# Altium schematic sheet CuC.SchDoc: CuC
size A4; Author: eldar6776@hotmail.com; DrawnBy: Eldar Dedić; Organization: PROVEN d.o.o.; Address1: Adema Buće 102; Address2: 71000 Sarajevo; Address3: Federacija BiH; Address4: Bosna i Hercegovina; DocumentNumber: DE211213; Revision: 001; SheetNumber: 2; SheetTotal: 15; ProjectName: MIKSER SIROVINE
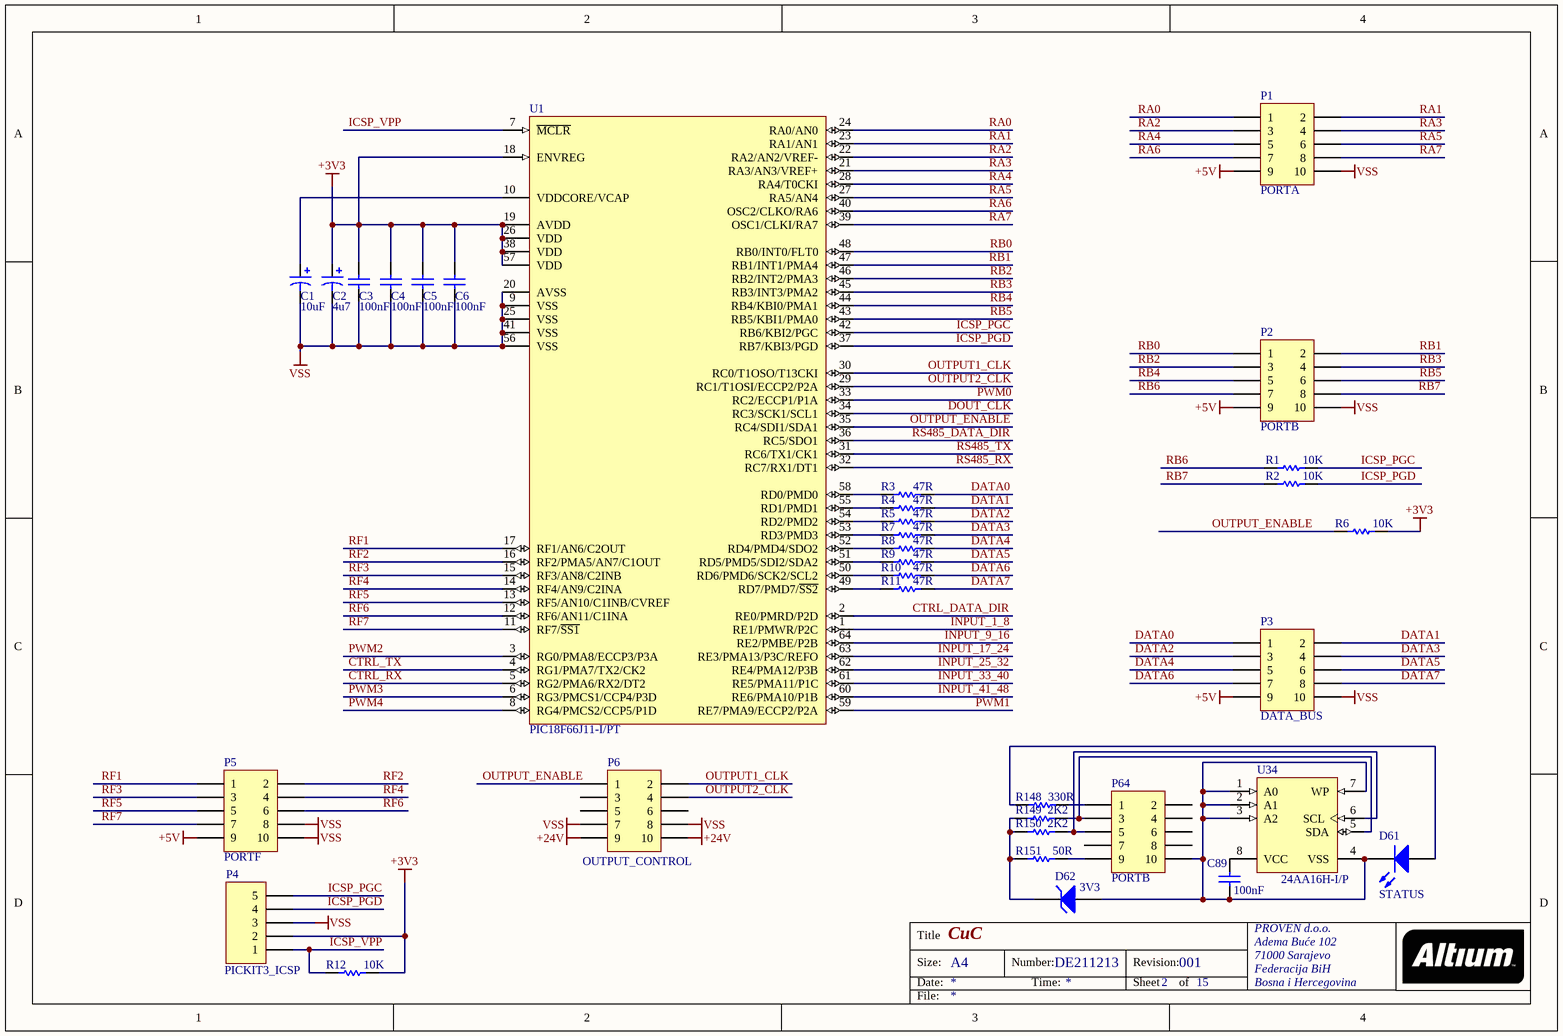
[diagram p0: CuC.SchDoc]

## Parts
C1  10uF  [CAPPR1.5-4X7]
C2  4u7  [CAPPR1.5-4X7]
C3  value 100nF  [1206]
C4  value 100nF  [1206]
C5  value 100nF  [1206]
C6  value 100nF  [1206]
C89  value 100nF  [1206]
D61  STATUS  [LED-0]
D62  3V3  [DIODE-0.7]
P1  PORTA  [HDR2X5]
P2  PORTB  [HDR2X5]
P3  DATA_BUS  [HDR2X5]
P4  PICKIT3_ICSP  [HDR1X5]
P5  PORTF  [HDR2X5]
P6  OUTPUT_CONTROL  [HDR2X5]
P64  PORTB  [HDR2X5]
R1  10K  [ERA-0603]
R2  10K  [ERA-0603]
R3  47R  [ERA-0603]
R4  47R  [ERA-0603]
R5  47R  [ERA-0603]
R6  10K  [ERA-0603]
R7  47R  [ERA-0603]
R8  47R  [ERA-0603]
R9  47R  [ERA-0603]
R10  47R  [ERA-0603]
R11  47R  [ERA-0603]
R12  10K  [ERA-0603]
R148  330R  [ERA-0603]
R149  2K2  [ERA-0603]
R150  2K2  [ERA-0603]
R151  50R  [ERA-0603]
U1  PIC18F66J11-I/PT  [TQFP-PT64_N]
U34  24AA16H-I/P  [PDIP300-P8]

## Nets
+3V3: C2.1 C3.1 C4.1 C5.1 C6.1 P4.2 R6.2 R12.2 U1.18(ENVREG) U1.19(AVDD) U1.26(VDD) U1.38(VDD) U1.57(VDD)
+5V: P1.9 P2.9 P3.9 P5.9
+24V: P6.9 P6.10
VSS: C1.2 C2.2 C3.2 C4.2 C5.2 C6.2 P1.10 P2.10 P3.10 P4.3 P5.8 P5.10 P6.7 P6.8 U1.9(VSS) U1.20(AVSS) U1.25(VSS) U1.41(VSS) U1.56(VSS)
CTRL_DATA_DIR: U1.2(RE0/PMRD/P2D)
CTRL_RX: U1.5(RG2/PMA6/RX2/DT2)
CTRL_TX: U1.4(RG1/PMA7/TX2/CK2)
DATA0: P3.1 R3.2
DATA1: P3.2 R4.2
DATA2: P3.3 R5.2
DATA3: P3.4 R7.2
DATA4: P3.5 R8.2
DATA5: P3.6 R9.2
DATA6: P3.7 R10.2
DATA7: P3.8 R11.2
DOUT_CLK: U1.34(RC3/SCK1/SCL1)
ICSP_PGC: P4.5 R1.2 U1.42(RB6/KBI2/PGC)
ICSP_PGD: P4.4 R2.2 U1.37(RB7/KBI3/PGD)
ICSP_VPP: P4.1 R12.1 U1.7(~{MCLR})
INPUT_1_8: U1.1(RE1/PMWR/P2C)
INPUT_9_16: U1.64(RE2/PMBE/P2B)
INPUT_17_24: U1.63(RE3/PMA13/P3C/REFO)
INPUT_25_32: U1.62(RE4/PMA12/P3B)
INPUT_33_40: U1.61(RE5/PMA11/P1C)
INPUT_41_48: U1.60(RE6/PMA10/P1B)
OUTPUT1_CLK: P6.2 U1.30(RC0/T1OSO/T13CKI)
OUTPUT2_CLK: P6.4 U1.29(RC1/T1OSI/ECCP2/P2A)
OUTPUT_ENABLE: P6.1 R6.1 U1.35(RC4/SDI1/SDA1)
PWM0: U1.33(RC2/ECCP1/P1A)
PWM1: U1.59(RE7/PMA9/ECCP2/P2A)
PWM2: U1.3(RG0/PMA8/ECCP3/P3A)
PWM3: U1.6(RG3/PMCS1/CCP4/P3D)
PWM4: U1.8(RG4/PMCS2/CCP5/P1D)
RA0: P1.1 U1.24(RA0/AN0)
RA1: P1.2 U1.23(RA1/AN1)
RA2: P1.3 U1.22(RA2/AN2/VREF-)
RA3: P1.4 U1.21(RA3/AN3/VREF+)
RA4: P1.5 U1.28(RA4/T0CKI)
RA5: P1.6 U1.27(RA5/AN4)
RA6: P1.7 U1.40(OSC2/CLKO/RA6)
RA7: P1.8 U1.39(OSC1/CLKI/RA7)
RB0: P2.1 U1.48(RB0/INT0/FLT0)
RB1: P2.2 U1.47(RB1/INT1/PMA4)
RB2: P2.3 U1.46(RB2/INT2/PMA3)
RB3: P2.4 U1.45(RB3/INT3/PMA2)
RB4: P2.5 U1.44(RB4/KBI0/PMA1)
RB5: P2.6 U1.43(RB5/KBI1/PMA0)
RB6: P2.7 R1.1
RB7: P2.8 R2.1
RF1: P5.1 U1.17(RF1/AN6/C2OUT)
RF2: P5.2 U1.16(RF2/PMA5/AN7/C1OUT)
RF3: P5.3 U1.15(RF3/AN8/C2INB)
RF4: P5.4 U1.14(RF4/AN9/C2INA)
RF5: P5.5 U1.13(RF5/AN10/C1INB/CVREF)
RF6: P5.6 U1.12(RF6/AN11/C1INA)
RF7: P5.7 U1.11(RF7/~{SS1})
RS485_DATA_DIR: U1.36(RC5/SDO1)
RS485_RX: U1.32(RC7/RX1/DT1)
RS485_TX: U1.31(RC6/TX1/CK1)
NetC1_1: C1.1 U1.10(VDDCORE/VCAP)
NetC89_1: C89.1 D61.2(K) D62.1(A) P64.10 U34.1(A0) U34.2(A1) U34.3(A2) U34.4(VSS) U34.7(WP)
NetC89_2: C89.2 U34.8(VCC)
NetD61_1: D61.1(A) R148.2
NetD62_2: D62.2(K) R149.1 R150.1 R151.1
NetP64_1: P64.1 R148.1
NetP64_3: P64.3 R149.2 U34.5(SDA)
NetP64_5: P64.5 R150.2 U34.6(SCL)
NetP64_9: P64.9 R151.2
NetR3_1: R3.1 U1.58(RD0/PMD0)
NetR4_1: R4.1 U1.55(RD1/PMD1)
NetR5_1: R5.1 U1.54(RD2/PMD2)
NetR7_1: R7.1 U1.53(RD3/PMD3)
NetR8_1: R8.1 U1.52(RD4/PMD4/SDO2)
NetR9_1: R9.1 U1.51(RD5/PMD5/SDI2/SDA2)
NetR10_1: R10.1 U1.50(RD6/PMD6/SCK2/SCL2)
NetR11_1: R11.1 U1.49(RD7/PMD7/~{SS2})

Not connected (* = marked no-connect by the designer): P6 3 5 6; P64 2 4 6 7 8

## Notes on the sheet
- Title
- Size:
- Date:
- A4
- Number:
- Time:
- Revision:
- Sheet
- of
- File:

## Library data of the parts
C1 C2 = EKF00MM147J00: Aluminum Electrolytic Capacitor, Radial Style with Long Leads: 4.7uF, 63V; Note: Refer to Manufacturer's Data Sheets for other lead formations; DrillSize: Nominal, Rounded To The Nearest 0.05mm; Published: 19-Mar-2004; DatasheetDocument: 13-Jan-2000; PackageReference: CAPPR1.5-4X7; Publisher: Altium Limited; ComponentLink1Description: Manufacturer Link; ComponentLink1URL: http://www.vishay.com/; ComponentLink2Description: Datasheet; ComponentLink2URL: http://www.vishay.com/docs/25004/ekf.pdf; Value: 4.7uF
C3-C6 C89 = C1206: Ceramic Chip Capacitor - Standard; Published: 17-Jul-2002; LatestRevisionDate: 19-Mar-2004; LatestRevisionNote: Silkscreen size reduced.; DatasheetDocument: Mar-2001; PackageDocument: Mar-2001; PackageReference: 1206; Publisher: Altium Limited; Code_JEITA: 1206; Code_IPC: 3216 [1206]; ComponentLink1Description: Manufacturer Link; ComponentLink1URL: http://www.kemet.com/; ComponentLink2Description: Datasheet; ComponentLink2URL: http://www.kemet.com/kemet/web/homepage/kechome.nsf/vapubfilesname/F3102TA.pdf/$file/F3102TA.pdf
D61 = LED0: Typical INFRARED GaAs LED; Published: 8-Jun-2000; LatestRevisionDate: 08-Jul-2005; LatestRevisionNote: Mech Layer 1 removed.; PackageReference: LED-0; Publisher: Altium Limited; PackageDescription: LED; 2 Leads
D62 = D Zener: Zener Diode; Published: 8-Jun-2000; LatestRevisionDate: 17-Jul-2002; LatestRevisionNote: Re-released for DXP Platform.; PackageReference: DIODE-0.7; Publisher: Altium Limited; PackageDescription: Diode, Thru-Hole; 2 Leads; 0.7 in Pin Spacing
P1-P3 P5 P6 P64 = Header 5X2: Header, 5-Pin, Dual row; LatestRevisionDate: 17-Jul-2002; LatestRevisionNote: Re-released for DXP Platform.; Publisher: Altium Limited
P4 = Header 5: Header, 5-Pin; LatestRevisionDate: 17-Jul-2002; LatestRevisionNote: Re-released for DXP Platform.; Publisher: Altium Limited
R1-R12 R148-R151 = ERA3Y: Rectangular Thick Film Chip Resistor, 10 Ohm to 330k Ohm Range, 0.1% and 0.5% Tolerance, 0603 Size, 0.063 W; Note: If flow soldering, adjust pad width of PCB Footprint to 0.7 - 0.8 times the width of the resistor.; Published: 17-Dec-2003; LatestRevisionDate: 19-Mar-2004; LatestRevisionNote: Silkscreen size reduced.; PackageDocument: Mar-2003; PackageReference: ERA-0603; Publisher: Altium Limited; Code_IPC: 1608 [0603]; ComponentLink1Description: Manufacturer Link; ComponentLink1URL: http://www.panasonic.com/industrial/components/resistive_products.htm; ComponentLink2Description: Datasheet; ComponentLink2URL: http://www.panasonic.com/industrial/components/pdf/AOA0000CE8.pdf
U1 = PIC18F66J11-I/PT: High Performance, 1-Mbit Flash Microcontroller with nanoWatt Technology, 64K Flash, 64-Pin TQFP, Industrial Temperature Range; Published: 29-Jan-2009; LatestRevisionDate: 02-Dec-2009; LatestRevisionNote: Updated to datasheet revision D, Oct-2009; DatasheetVersion: revD, Oct-2009; PackageVersion: revBB, Aug-2009; PackageReference: TQFP-PT64; Publisher: Altium Limited; PackageDescription: 64-Lead Thin Plastic Quad Flat Pack (PT) - 10x10x1mm Body, 2.00mm [TQFP]; Supplier 1: Digi-Key; Supplier Part Number 1: PIC18F66J11-I/PT-ND; Code_JEDEC: MS-026; ComponentLink1Description: Datasheet; ComponentLink1URL: http://ww1.microchip.com/downloads/en/DeviceDoc/39778d.pdf; ComponentLink2Description: Packaging Specification; ComponentLink2URL: http://www.microchip.com/stellent/groups/techpub_sg/documents/packagingspec/en012702.pdf; ComponentLink3Description: Microchip.com Home; ComponentLink3URL: http://www.microchip.com/
U34 = 24AA16H-I/P: 16Kbit, 400kHz, 1.7V, I2C Serial EEPROM, 8-Pin PDIP, Industrial Temperature; Published: 2-Dec-2009; DatasheetVersion: revA, Nov-2008; PackageVersion: revBB, Aug-2009; PackageReference: PDIP300-P8; Publisher: Altium Limited; PackageDescription: 8-Lead Plastic Dual In-Line (P) - 300 mil Body [PDIP]; Supplier 1: Digi-Key; Supplier Part Number 1: 24AA16H-I/P-ND; Code_JEDEC: MS-001; ComponentLink1Description: Datasheet; ComponentLink1URL: http://ww1.microchip.com/downloads/en/DeviceDoc/22118A.pdf; ComponentLink2Description: Packaging Specification; ComponentLink2URL: http://www.microchip.com/stellent/groups/techpub_sg/documents/packagingspec/en012702.pdf; ComponentLink3Description: Microchip.com Home; ComponentLink3URL: http://www.microchip.com/